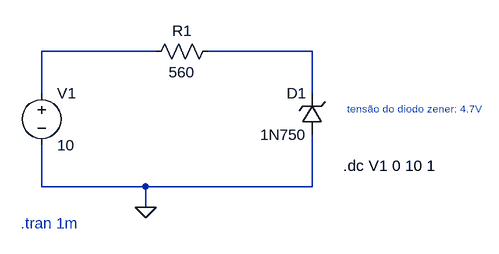
[diagram p0: schematic Determinar a tensão do diodo Zener.asc]
Determinar a tensão do diodo Zener.asc, the LTspice schematic file:
Version 4
SHEET 1 880 680
WIRE 176 64 0 64
WIRE 416 64 256 64
WIRE 0 128 0 64
WIRE 416 128 416 64
WIRE 0 272 0 208
WIRE 160 272 0 272
WIRE 416 272 416 192
WIRE 416 272 160 272
WIRE 160 304 160 272
FLAG 160 304 0
SYMBOL voltage 0 112 R0
SYMATTR InstName V1
SYMATTR Value 10
SYMBOL zener 432 192 R180
WINDOW 0 24 64 Left 2
WINDOW 3 24 0 Left 2
SYMATTR InstName D1
SYMATTR Value 1N750
SYMBOL res 272 48 R90
WINDOW 0 0 56 VBottom 2
WINDOW 3 32 56 VTop 2
SYMATTR InstName R1
SYMATTR Value 560
TEXT -32 328 Left 2 ;.tran 1m
TEXT 672 152 Right 1 ;tensão do diodo zener: 4.7V
TEXT 464 240 Left 2 !.dc V1 0 10 1

The netlist it stands for:
* Determinar a tensão do diodo Zener.asc
V1 N001 0 10
D1 0 N002 1N750
R1 N002 N001 560
.model D D
.lib standard.dio
* .tran 1m
* tensão do diodo zener: 4.7V
.dc V1 0 10 1
.backanno
.end